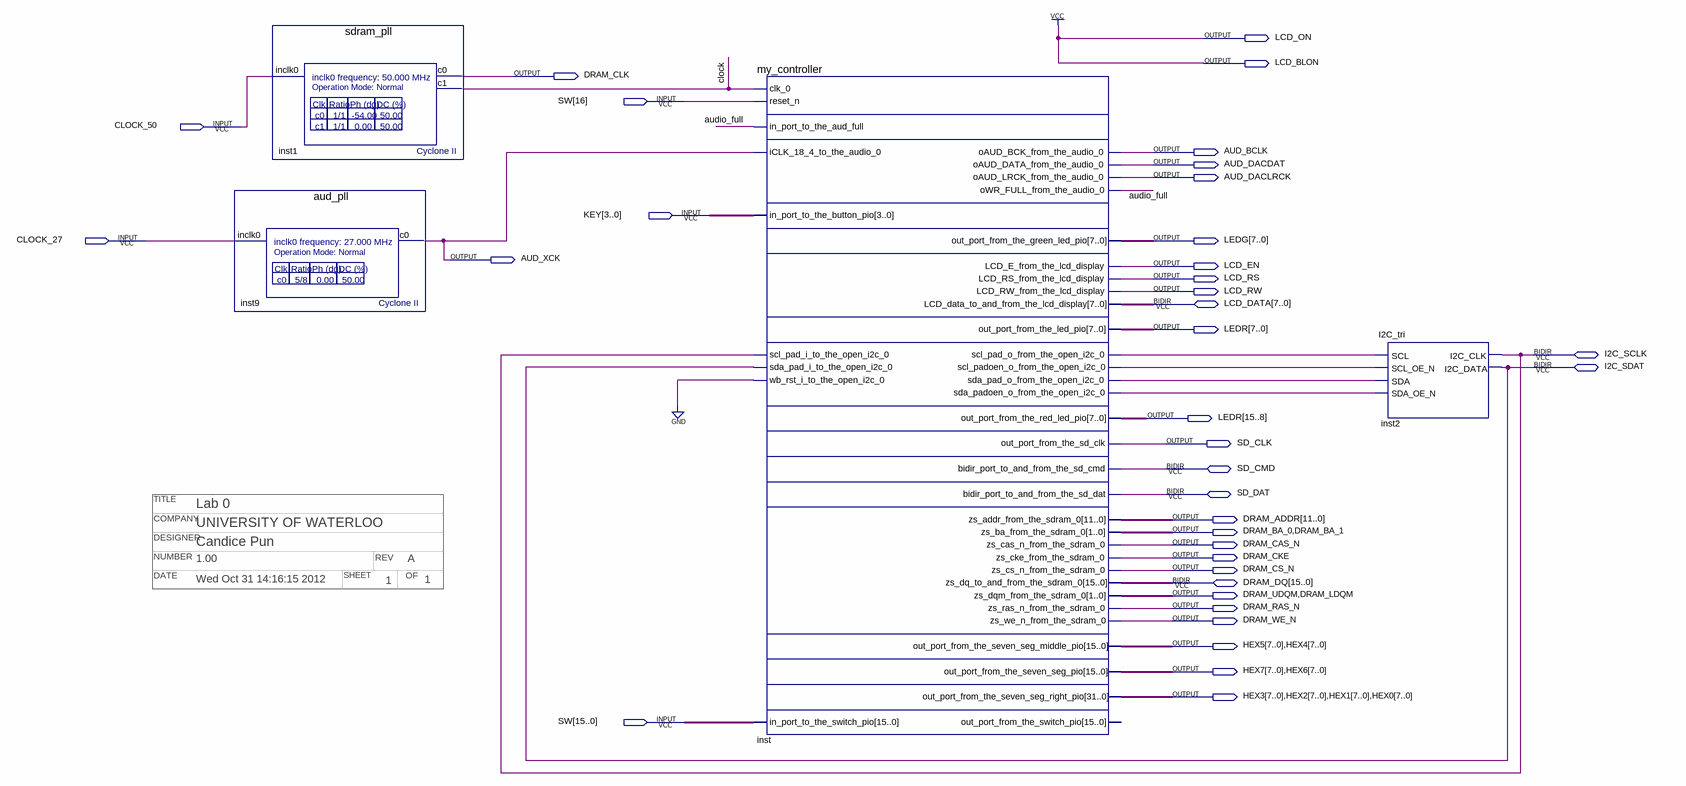
[diagram p0: schematic sheet]
// Quartus schematic myESystem.bdf as structural Verilog: 4 symbols, 36 pins
// Title block: TITLE: Lab 0; COMPANY: UNIVERSITY OF WATERLOO; DESIGNER: Candice Pun; NUMBER: 1.00; REV: A; DATE: Wed Oct 31 14:16:15 2012; SHEET: 1; OF: 1
module myESystem (
  input  [16:0] SW,
  input  CLOCK_50,
  input  [3:0] KEY,
  input  CLOCK_27,
  inout  [7:0] LCD_DATA,
  inout  I2C_SCLK,
  inout  I2C_SDAT,
  inout  SD_CMD,
  inout  SD_DAT,
  inout  [15:0] DRAM_DQ,
  output LCD_ON,
  output LCD_BLON,
  output DRAM_CLK,
  output AUD_BCLK,
  output AUD_DACDAT,
  output AUD_DACLRCK,
  output [7:0] LEDG,
  output AUD_XCK,
  output LCD_EN,
  output LCD_RS,
  output LCD_RW,
  output [15:0] LEDR,
  output SD_CLK,
  output [11:0] DRAM_ADDR,
  output DRAM_BA_0,
  output DRAM_BA_1,
  output DRAM_CAS_N,
  output DRAM_CKE,
  output DRAM_CS_N,
  output DRAM_UDQM,
  output DRAM_LDQM,
  output DRAM_RAS_N,
  output DRAM_WE_N,
  output [7:0] HEX5,
  output [7:0] HEX4,
  output [7:0] HEX7,
  output [7:0] HEX6,
  output [7:0] HEX3,
  output [7:0] HEX2,
  output [7:0] HEX1,
  output [7:0] HEX0
);

  wire audio_full, clock, inst_scl_pad_o_from_the_open_i2c_0, inst_scl_padoen_o_from_the_open_i2c_0,
       inst_sda_pad_o_from_the_open_i2c_0, inst_sda_padoen_o_from_the_open_i2c_0;

  aud_pll inst9 (.inclk0(CLOCK_27), .c0(AUD_XCK));
  sdram_pll inst1 (.inclk0(CLOCK_50), .c0(DRAM_CLK), .c1(clock));
  my_controller inst (
    .clk_0(clock), .reset_n(SW[16]), .in_port_to_the_aud_full(audio_full),
    .iCLK_18_4_to_the_audio_0(AUD_XCK), .in_port_to_the_button_pio(KEY),
    .scl_pad_i_to_the_open_i2c_0(I2C_SCLK), .sda_pad_i_to_the_open_i2c_0(I2C_SDAT),
    .wb_rst_i_to_the_open_i2c_0(1'b0), .in_port_to_the_switch_pio(SW[15:0]),
    .oAUD_BCK_from_the_audio_0(AUD_BCLK), .oAUD_DATA_from_the_audio_0(AUD_DACDAT),
    .oAUD_LRCK_from_the_audio_0(AUD_DACLRCK), .oWR_FULL_from_the_audio_0(audio_full),
    .out_port_from_the_green_led_pio(LEDG), .LCD_E_from_the_lcd_display(LCD_EN),
    .LCD_RS_from_the_lcd_display(LCD_RS), .LCD_RW_from_the_lcd_display(LCD_RW),
    .out_port_from_the_led_pio(LEDR[7:0]),
    .scl_pad_o_from_the_open_i2c_0(inst_scl_pad_o_from_the_open_i2c_0),
    .scl_padoen_o_from_the_open_i2c_0(inst_scl_padoen_o_from_the_open_i2c_0),
    .sda_pad_o_from_the_open_i2c_0(inst_sda_pad_o_from_the_open_i2c_0),
    .sda_padoen_o_from_the_open_i2c_0(inst_sda_padoen_o_from_the_open_i2c_0),
    .out_port_from_the_red_led_pio(LEDR[15:8]), .out_port_from_the_sd_clk(SD_CLK),
    .zs_addr_from_the_sdram_0(DRAM_ADDR), .zs_ba_from_the_sdram_0({DRAM_BA_0, DRAM_BA_1}),
    .zs_cas_n_from_the_sdram_0(DRAM_CAS_N), .zs_cke_from_the_sdram_0(DRAM_CKE),
    .zs_cs_n_from_the_sdram_0(DRAM_CS_N), .zs_dqm_from_the_sdram_0({DRAM_UDQM, DRAM_LDQM}),
    .zs_ras_n_from_the_sdram_0(DRAM_RAS_N), .zs_we_n_from_the_sdram_0(DRAM_WE_N),
    .out_port_from_the_seven_seg_middle_pio({HEX5, HEX4}), .out_port_from_the_seven_seg_pio({HEX7, HEX6}),
    .out_port_from_the_seven_seg_right_pio({HEX3, HEX2, HEX1, HEX0}),
    .LCD_data_to_and_from_the_lcd_display(LCD_DATA), .bidir_port_to_and_from_the_sd_cmd(SD_CMD),
    .bidir_port_to_and_from_the_sd_dat(SD_DAT), .zs_dq_to_and_from_the_sdram_0(DRAM_DQ));  // open: out_port_from_the_switch_pio
  I2C_tri inst2 (
    .SCL(inst_scl_pad_o_from_the_open_i2c_0), .SCL_OE_N(inst_scl_padoen_o_from_the_open_i2c_0),
    .SDA(inst_sda_pad_o_from_the_open_i2c_0), .SDA_OE_N(inst_sda_padoen_o_from_the_open_i2c_0),
    .I2C_CLK(I2C_SCLK), .I2C_DATA(I2C_SDAT));

  assign LCD_BLON = 1'b1;
  assign LCD_ON = 1'b1;
endmodule
